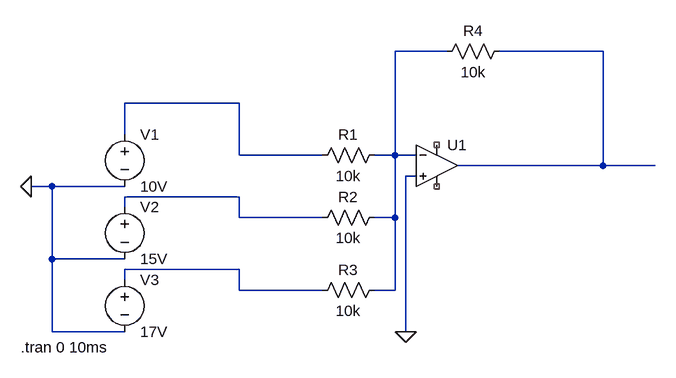
[diagram p0: schematic adder.asc]
adder.asc, the LTspice schematic file:
Version 4.1
SHEET 1 880 680
WIRE 240 -16 160 -16
WIRE 480 -16 320 -16
WIRE -80 64 -256 64
WIRE -256 112 -256 64
WIRE -80 144 -80 64
WIRE 48 144 -80 144
WIRE 160 144 160 -16
WIRE 160 144 128 144
WIRE 192 144 160 144
WIRE 480 160 480 -16
WIRE 480 160 256 160
WIRE 560 160 480 160
WIRE 192 176 176 176
WIRE -368 192 -400 192
WIRE -256 192 -368 192
WIRE -80 208 -256 208
WIRE -256 224 -256 208
WIRE -80 240 -80 208
WIRE 48 240 -80 240
WIRE 160 240 160 144
WIRE 160 240 128 240
WIRE -368 304 -368 192
WIRE -256 304 -368 304
WIRE -80 320 -256 320
WIRE -256 336 -256 320
WIRE -80 352 -80 320
WIRE 48 352 -80 352
WIRE 160 352 160 240
WIRE 160 352 128 352
WIRE -368 416 -368 304
WIRE -256 416 -368 416
WIRE 176 416 176 176
FLAG -400 192 0
FLAG 176 416 0
SYMBOL res 144 128 R90
WINDOW 0 0 56 VBottom 2
WINDOW 3 32 56 VTop 2
SYMATTR InstName R1
SYMATTR Value 10k
SYMBOL res 144 224 R90
WINDOW 0 0 56 VBottom 2
WINDOW 3 32 56 VTop 2
SYMATTR InstName R2
SYMATTR Value 10k
SYMBOL res 144 336 R90
WINDOW 0 0 56 VBottom 2
WINDOW 3 32 56 VTop 2
SYMATTR InstName R3
SYMATTR Value 10k
SYMBOL voltage -256 96 R0
WINDOW 123 0 0 Left 0
WINDOW 39 0 0 Left 0
SYMATTR InstName V1
SYMATTR Value 10V
SYMBOL voltage -256 208 R0
WINDOW 123 0 0 Left 0
WINDOW 39 0 0 Left 0
SYMATTR InstName V2
SYMATTR Value 15V
SYMBOL voltage -256 320 R0
WINDOW 123 0 0 Left 0
WINDOW 39 0 0 Left 0
SYMATTR InstName V3
SYMATTR Value 17V
SYMBOL res 336 -32 R90
WINDOW 0 0 56 VBottom 2
WINDOW 3 32 56 VTop 2
SYMATTR InstName R4
SYMATTR Value 10k
SYMBOL OpAmps\\UniversalOpAmp 224 160 R0
SYMATTR InstName U1
TEXT -416 440 Left 2 !.tran 0 10ms

The netlist it stands for:
* adder.asc
R1 N001 N003 10k
R2 N001 N004 10k
R3 N001 N005 10k
V1 N003 0 10V
V2 N004 0 15V
V3 N005 0 17V
R4 N002 N001 10k
X§U1 0 N001 NC_01 NC_02 N002 level1 Avol=1Meg GBW=10Meg Vos=0 En=0 Enk=0 In=0 Ink=0 Rin=500Meg  ; pins In+ In- V+ V- OUT
.tran 0 10ms
.lib UniversalOpAmp1.lib
.backanno
.end